# EAGLE board vr61-revB (EAGLE 9.6.2), part 1 of 2
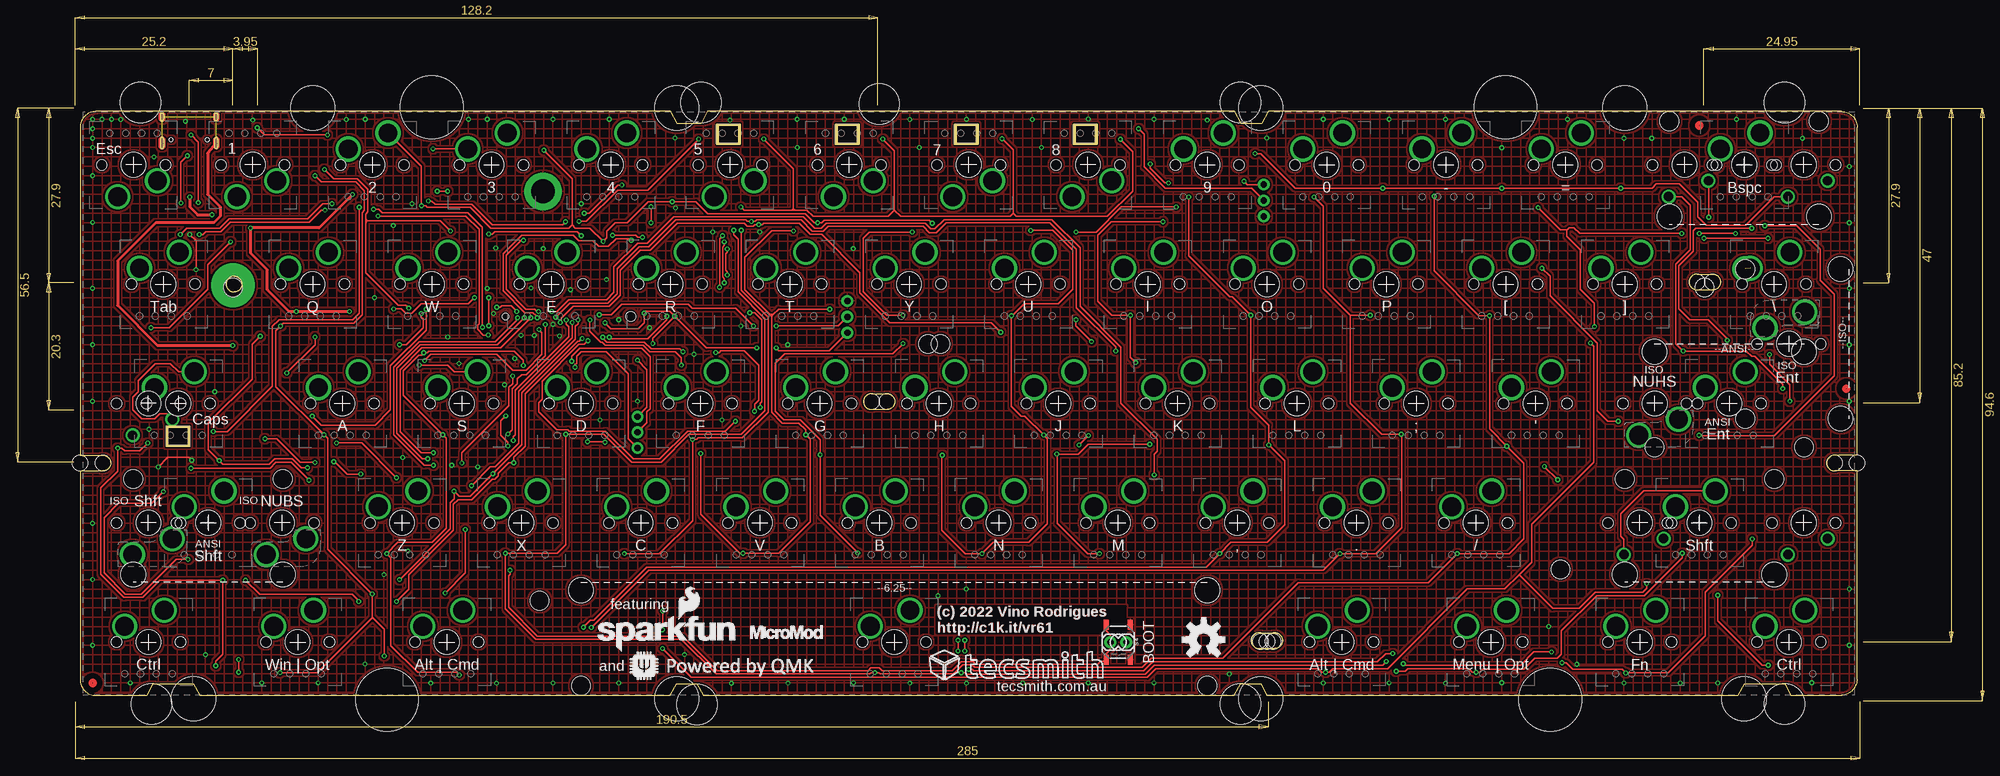
[diagram p2: board, top side]
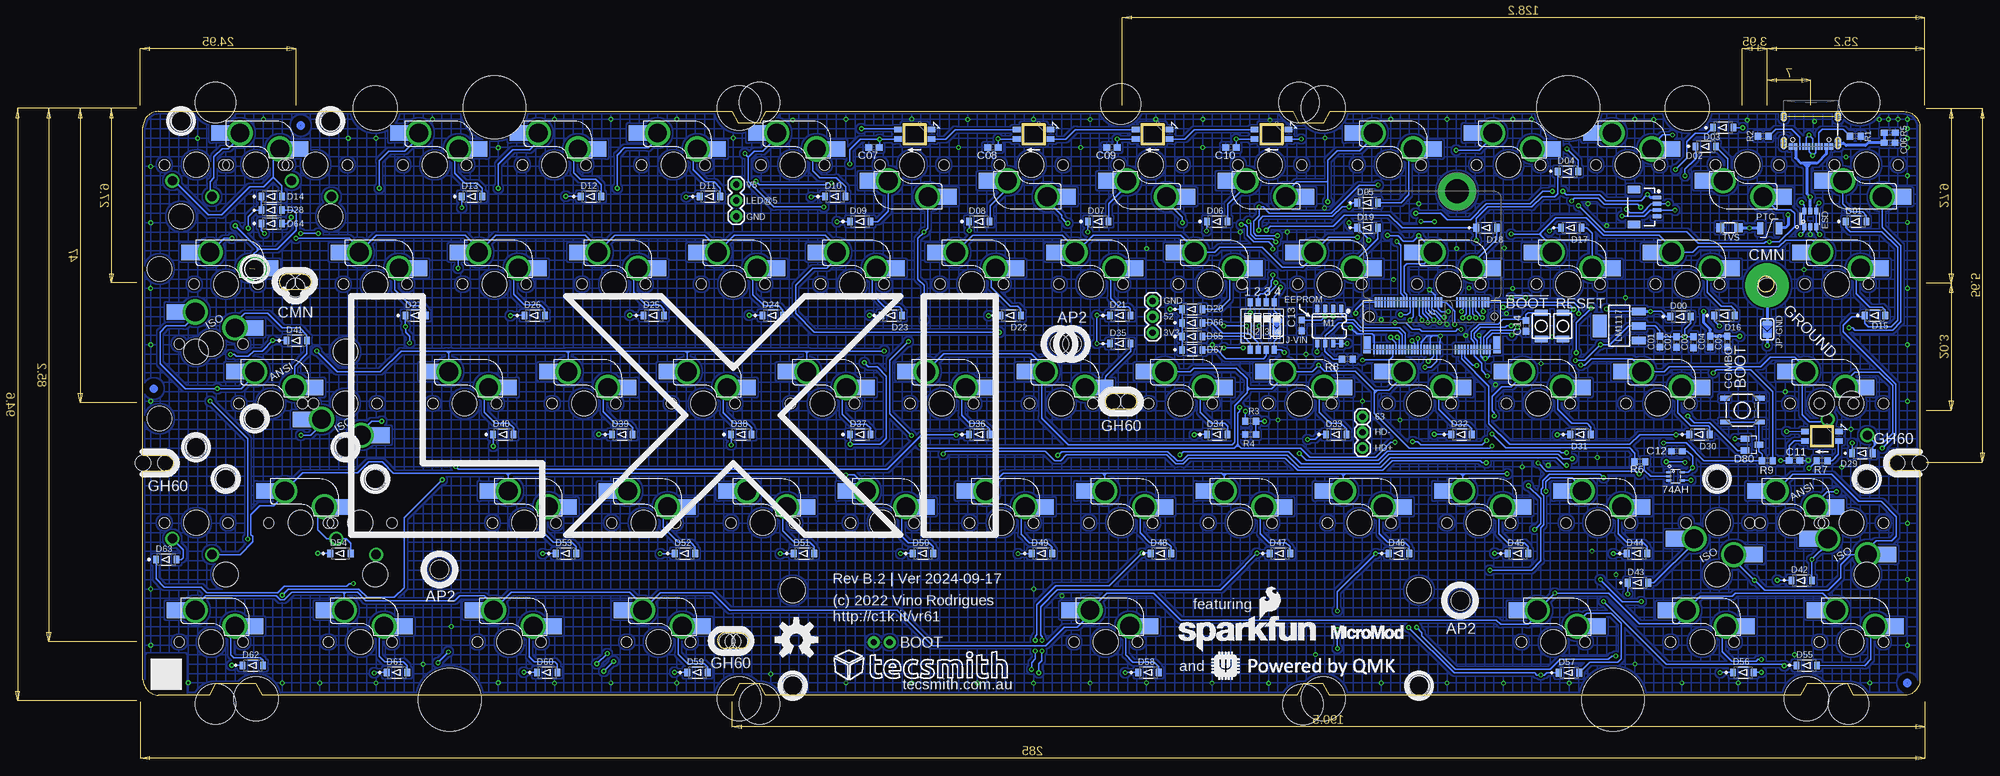
[diagram p3: board, bottom side, seen from below]

Size 314.35 x 118.85 mm. Coordinates in mm from the lower left corner, seen from the top.
Outline: 291.26,46.47 291.14,46.47
Outline: 136.6,58.47 arc180 136.65,55.97 139.14,55.97 arc180 139.12,58.47 136.6,58.47
Copper layers (1*16): Top 0.035mm / dielectric 1.5mm / Bottom 0.035mm
Design rules "jlcpcb *": minimum track width 5mil, minimum drill 0.3mm, track to track 9.5mil, track to pad 9.5mil, pad to pad 9.5mil, via to via 9.5mil, smd to smd 9.5mil, copper to edge 0.2mm, drill to drill 6mil, minimum pad ring 3mil, minimum via ring 8mil, stop-mask expansion 0mil, vias tented up to drill 15mil, thermal gap 10mil
Net classes: 0 default: width 0 mm, drill 0 mm
Holes 2.5 mm at 199.8,18.9 198.8,18.9 200.8,18.9

## Footprints (pad centres in the part's own frame; a part is rotated, then mirrored left to right if it is on the bottom)
SC-88A__TSSOP5__SOT353-1 = smd 0.375 x 0.825: 1 -0.65,-1.087; 2 0,-1.087; 3 0.65,-1.087; 4 0.65,1.087; 6 -0.65,1.087
0603 = smd 1.1 x 1: 1 -0.85,0; 2 0.85,0
C0603 = smd 1.1 x 1: 1 -0.85,0; 2 0.85,0
SOD-123 = smd 0.914 x 1.219: A 1.638,0; C -1.638,0
SOT23 = smd 1 x 1.4: 1 -0.95,-1.1; 2 0.95,-1.1; 3 0,1.1
DIP-1.27-004 = smd 0.76 x 1.27: 1 -1.905,-3.81; 2 -0.635,-3.81; 3 0.635,-3.81; 4 1.905,-3.81; 5 1.905,3.81; 6 0.635,3.81; 7 -0.635,3.81; 8 -1.905,3.81
SOT-23-6L = smd 0.6 x 1.1: P$1 -0.95,-1.25; P$2 0,-1.25; P$3 0.95,-1.25; P$4 0.95,1.25; P$5 0,1.25; P$6 -0.95,1.25
FOOTPRINT-AP2 = hole 3: 24,65; 73,15; 137,56; 236,20; 259,65; 135,56
STAND-OFF-REFLOW-M2.5 = drill 3.8 pad 6: 1 0,0
1X03 = drill 1.016 pad 1.88: 1 0,0; 2 2.54,0; 3 5.08,0
1X01 = drill 1.016 pad 1.88: 1 0,0
1X02 = drill 1.016 pad 1.88: 1 0,0; 2 2.54,0
USB-C-16P = smd 0.3 x 1: A5 -1.25,-0.34; A6 -0.25,-0.34; A7 0.25,-0.34; A8 1.25,-0.34; B5 1.75,-0.34; B6 0.75,-0.34; B7 -0.75,-0.34; B8 -1.75,-0.34 | smd 0.6 x 1: GND -3.225,-0.34; GND2 3.225,-0.34; VBUS1 -2.45,-0.34; VBUS2 2.45,-0.34 | smd 1 x 2.1: SHLD1 -4.32,-0.915; SHLD2 4.32,-0.915 | smd 1 x 2.1 bottom: SHLD3 -4.32,-0.915; SHLD4 4.32,-0.915 | smd 1 x 1.6: SHLD5 -4.32,-5.095; SHLD8 4.32,-5.095 | smd 1 x 1.6 bottom: SHLD6 -4.32,-5.095; SHLD7 4.32,-5.095 | hole 0.65: -2.89,-1.445; 2.89,-1.445
1X04_1MM_RA = smd 0.6 x 1.35: 1 -1.5,0; 2 -0.5,0; 3 0.5,0; 4 1.5,0 | smd 1.2 x 2: NC1 2.8,-3.675; NC2 -2.8,-3.675
SOLDERJUMPER_ARROW_NOPASTE = smd 0.762 x 1.524: 1 -1.016,0; 2 1.016,0
SK6812-E-MILL = smd 1.2 x 0.9 bottom: 1-VDD 2.7,-0.75; 2-DOUT 2.7,0.75; 3-GND -2.7,0.75; 4-DIN -2.7,-0.75
SOT223 = smd 1.219 x 2.235: 1 -2.311,-3.099; 2 0,-3.099; 3 2.311,-3.099 | smd 3.6 x 2.2: 4 0,3.099
8-SOIC = smd 0.6 x 1.2: 1 -1.905,-2.8; 2 -0.635,-2.8; 3 0.635,-2.8; 4 1.905,-2.8; 5 1.905,2.8; 6 0.635,2.8; 7 -0.635,2.8; 8 -1.905,2.8
SMD_PTC = smd 1 x 1.9: P$1 -1.5,0; P$2 1.5,0
R0603 = smd 1 x 1.1: 1 -0.85,0; 2 0.85,0
SKRKAEE020 = smd 1 x 2: 1 -2.1,0; 2 2.1,0
TACTILE_SWITCH_SMD_5.2MM = smd 1.524 x 0.762: 1 -2.794,1.905; 2 2.794,1.905; 3 -2.794,-1.905; 4 2.794,-1.905
MX-5-PIN-HOTSWAP-PAD = smd 3.15 x 2.5 bottom: 1@1 -6.785,2.54; 2@1 5.542,5.08 | drill 3 pad 3.75: 1@2 -3.81,2.54; 2@2 2.54,5.08 | hole 3.988: 0,0 | hole 1.7: -5.08,0; 5.08,0
MX-5-PIN-HOTSWAP-PAD-NS = smd 3.15 x 2.5 bottom: 1@1 -6.785,2.54; 2@1 5.542,5.08 | drill 3 pad 3.75: 1@2 -3.81,2.54; 2@2 2.54,5.08 | hole 3.988: 0,0 | hole 1.7: -5.08,0; 5.08,0
MX-5-PIN-MILMAX-3305-X-NS = drill 1.5: 1 -3.81,2.54; 2 2.54,5.08 | hole 3.988: 0,0 | hole 1.7: -5.08,0; 5.08,0
MX-STABS-200U = hole 3.988: -11.938,8.255; 11.938,8.255 | hole 3.048: -11.938,-6.985; 11.938,-6.985
MX-STABS-625U = hole 3.988: -50,8.255; 50,8.255 | hole 3.048: -50,-6.985; 50,-6.985
SOD123FL-BI = smd 1.3 x 1.4: P$1 -1.45,0; P$2 1.45,0
FOOTPRINT-BAKENEKO60 = hole 6.5: 10.6,95.65; 100.14,95.65; 186.3,95.65; 273.15,95.65; 12.4,-0.4; 99.46,-0.41; 186.3,-0.4; 273.15,-0.4 | hole 7.11: 38.13,94.78; 96.25,94.78; 189.5,94.78; 247.62,94.78; 19.08,0.47; 96.25,0.47; 189.5,0.47; 266.68,0.47 | hole 10.04: 57.15,94.92; 228.6,94.92; 50.01,0.31; 235.74,0.31 | hole 6.47: 128.59,95.46 | hole 2.5: 4.616,38.1; 281.134,38.1; 25.575,66.675; 1,38.1; 284.75,38.1; 261.675,67.025; 259.175,67.025; 129.837,47.924; 127.337,47.924; 189.244,9.76; 191.744,9.76
M.2-CONNECTOR-E = smd 0.3 x 1.55: 1 9.25,-5.275; 2 9,2.275; 3 8.75,-5.275; 4 8.5,2.275; 5 8.25,-5.275; 6 8,2.275; 7 7.75,-5.275; 8 7.5,2.275; 9 7.25,-5.275; 10 7,2.275; 11 6.75,-5.275; 12 6.5,2.275; 13 6.25,-5.275; 14 6,2.275; 15 5.75,-5.275; 16 5.5,2.275; 17 5.25,-5.275; 18 5,2.275; 19 4.75,-5.275; 20 4.5,2.275; 21 4.25,-5.275; 22 4,2.275; 23 3.75,-5.275; 32 1.5,2.275; 33 1.25,-5.275; 34 1,2.275; 35 0.75,-5.275; 36 0.5,2.275; 37 0.25,-5.275; 38 0,2.275; 39 -0.25,-5.275; 40 -0.5,2.275; 41 -0.75,-5.275; 42 -1,2.275; 43 -1.25,-5.275; 44 -1.5,2.275; 45 -1.75,-5.275; 46 -2,2.275; 47 -2.25,-5.275; 48 -2.5,2.275; 49 -2.75,-5.275; 50 -3,2.275; 51 -3.25,-5.275; 52 -3.5,2.275; 53 -3.75,-5.275; 54 -4,2.275; 55 -4.25,-5.275; 56 -4.5,2.275; 57 -4.75,-5.275; 58 -5,2.275; 59 -5.25,-5.275; 60 -5.5,2.275; 61 -5.75,-5.275; 62 -6,2.275; 63 -6.25,-5.275; 64 -6.5,2.275; 65 -6.75,-5.275; 66 -7,2.275; 67 -7.25,-5.275; 68 -7.5,2.275; 69 -7.75,-5.275; 70 -8,2.275; 71 -8.25,-5.275; 72 -8.5,2.275; 73 -8.75,-5.275; 74 -9,2.275; 75 -9.25,-5.275 | smd 1.2 x 2.75: A1 10.35,-4.5; A2 -10.35,-4.5 | hole 1.1: 10,0 | hole 1.6: -10,0

## Placement (x,y rotation side)
74AH  74AHCT1G125GW  [SC-88A__TSSOP5__SOT353-1]  49.3,45.3 270 bottom
C01  100nF  [0603]  51.8,66.8 270 bottom
C02  22uF  [0603]  49.15,66.75 270 bottom
C03  4.7uF  [0603]  46.45,66.7 270 bottom
C04  100nF  [0603]  43.75,66.8 270 bottom
C05  22uF  [0603]  41.05,66.8 270 bottom
C06  4.7nF  [0603]  15.12,98.57 0 bottom
C07  100nF  [C0603]  177.3,97.8 180 bottom
C08  100nF  [C0603]  158.3,97.8 180 bottom
C09  100nF  [C0603]  139.3,97.8 180 bottom
C10  100nF  [C0603]  120.3,97.8 180 bottom
C11  100nF  [C0603]  30.3,47.8 0 bottom
C12  0.1uF  [C0603]  49.1,49.3 180 bottom
C13  100nF  [C0603]  109,69.4 270 bottom
C14  100nF  [C0603]  73.2,69.33 270 bottom
D00  B5819W SL  [SOD-123]  48.5,70.8 0 bottom
D01  [SOD-123]  20.48,85.97 0 bottom
D02  [SOD-123]  44.47,97.97 0 bottom
D03  [SOD-123]  41.69,100.97 0 bottom
D04  [SOD-123]  66.47,93.97 0 bottom
D05  [SOD-123]  98.47,88.97 0 bottom
D06  [SOD-123]  122.47,85.97 0 bottom
D07  [SOD-123]  141.48,85.97 0 bottom
D08  [SOD-123]  160.48,85.97 0 bottom
D09  [SOD-123]  179.48,85.97 0 bottom
D10  [SOD-123]  183.48,89.97 0 bottom
D11  [SOD-123]  203.48,89.97 0 bottom
D12  [SOD-123]  222.48,89.97 0 bottom
D13  [SOD-123]  241.48,89.97 0 bottom
D14  [SOD-123]  273.48,89.97 0 bottom
D15  [SOD-123]  17.48,70.97 0 bottom
D16  [SOD-123]  41.47,70.97 0 bottom
D17  [SOD-123]  65.97,84.97 0 bottom
D18  [SOD-123]  79.47,84.97 0 bottom
D19  [SOD-123]  98.47,84.97 0 bottom
D20  [SOD-123]  126.47,71.97 0 bottom
D21  [SOD-123]  137.98,70.97 0 bottom
D22  [SOD-123]  155.48,70.97 0 bottom
D23  [SOD-123]  174.48,70.97 0 bottom
D24  [SOD-123]  193.48,70.97 0 bottom
D25  [SOD-123]  212.48,70.97 0 bottom
D26  [SOD-123]  231.48,70.97 0 bottom
D27  [SOD-123]  250.48,70.97 0 bottom
D28  [SOD-123]  273.48,87.8 0 bottom
D29  [SOD-123]  19.48,48.97 0 bottom
D30  [SOD-123]  45.47,51.97 0 bottom
D31  [SOD-123]  64.47,51.97 0 bottom
D32  [SOD-123]  83.47,51.97 0 bottom
D33  [SOD-123]  103.47,51.97 0 bottom
D34  [SOD-123]  122.47,51.97 0 bottom
D35  [SOD-123]  137.98,66.47 0 bottom
D36  [SOD-123]  160.48,51.97 0 bottom
D37  [SOD-123]  179.48,51.97 0 bottom
D38  [SOD-123]  198.48,51.97 0 bottom
D39  [SOD-123]  217.48,51.97 0 bottom
D40  [SOD-123]  236.48,51.97 0 bottom
D41  [SOD-123]  269.48,66.97 0 bottom
D42  [SOD-123]  29.18,28.68 0 bottom
D43  [SOD-123]  55.3,28.3 0 bottom
D44  [SOD-123]  55.47,32.98 0 bottom
D45  [SOD-123]  74.47,32.98 0 bottom
D46  [SOD-123]  93.47,32.98 0 bottom
D47  [SOD-123]  112.47,32.98 0 bottom
D48  [SOD-123]  131.47,32.98 0 bottom
D49  [SOD-123]  150.48,32.98 0 bottom
D50  [SOD-123]  169.48,32.98 0 bottom
D51  [SOD-123]  188.48,32.98 0 bottom
D52  [SOD-123]  207.48,32.98 0 bottom
D53  [SOD-123]  226.48,32.98 0 bottom
D54  [SOD-123]  262.48,32.98 0 bottom
D55  [SOD-123]  28.34,15.1 0 bottom
D56  [SOD-123]  38.48,13.98 0 bottom
D57  [SOD-123]  66.3,13.94 0 bottom
D58  [SOD-123]  133.47,13.98 0 bottom
D59  [SOD-123]  205.48,13.98 0 bottom
D60  [SOD-123]  229.48,13.98 0 bottom
D61  [SOD-123]  253.48,13.98 0 bottom
D62  [SOD-123]  276.48,15.1 0 bottom
D63  [SOD-123]  290.3,32 0 bottom
D64  [SOD-123]  273.48,85.65 0 bottom
D65  [SOD-123]  126.47,67.62 0 bottom
D66  [SOD-123]  126.47,69.8 0 bottom
D67  [SOD-123]  126.47,65.47 0 bottom
D80  BAS70-05  [SOT23]  37.1,50.35 270 bottom
DIP-SW  DIP004  [DIP-1.27-004]  115.3,69.3 0 bottom
ESD  ESD_SRV05-4  [SOT-23-6L]  27.8,86.4 0 bottom
FP_AP2  FOOTPRINT-AP2  [FOOTPRINT-AP2]  10.68,10.43 0 top
H5  STAND-OFF-REFLOW2.5MM_TALL  [STAND-OFF-REFLOW-M2.5]  84.2,90.79 0 top
J-52  [1X03]  132.8,73.3 270 bottom
J-63  [1X01]  99.3,54.8 0 bottom
J-BOOT  [1X02]  174.8,18.8 0 top
J-HOST  [1X02]  99.3,49.8 90 bottom
J-LED  [1X03]  199.3,86.8 90 bottom
J-UBS  [USB-C-16P]  27.69,97.6 180 bottom
J-UDB  SM04B-SRSS-TB(LF)(SN)  [1X04_1MM_RA]  52.3,88.3 270 bottom
J-VIN  [SOLDERJUMPER_ARROW_NOPASTE]  113,69.28 270 bottom
JP-GND  G-OPT  [SOLDERJUMPER_ARROW_NOPASTE]  34.67,68.78 270 bottom
LED-5  SK6812-E-REVERSE  [SK6812-E-MILL]  113.8,99.9 0 top
LED-6  SK6812-E-REVERSE  [SK6812-E-MILL]  132.8,99.9 0 top
LED-7  SK6812-E-REVERSE  [SK6812-E-MILL]  151.8,99.9 0 top
LED-8  SK6812-E-REVERSE  [SK6812-E-MILL]  170.8,99.9 0 top
LED-CL  SK6812-E-REVERSE  [SK6812-E-MILL]  25.93,51.7 0 top
LM1117  AMS1117-3.3  [SOT223]  58.3,69.3 90 bottom
LOGO1  OSHW-LOGOL  [OSHW-LOGO-L]  189.7,19.2 0 top
LOGO2  OSHW-LOGOL  [OSHW-LOGO-L]  189.7,19.2 0 bottom
M1  M25C  [8-SOIC]  104.6,69.3 180 bottom
PTC  PTC_ASMD1206-150  [SMD_PTC]  34.3,84.9 180 bottom
R1  5.1K  [R0603]  20.6,99.6 0 bottom
R2  5.1K  [R0603]  35.3,99.6 180 bottom
R3  150K  [R0603]  117.15,54.1 180 bottom
R4  75K  [R0603]  117.15,51.97 0 bottom
R5  1000K  [0603]  15.1,100.16 180 bottom
R6  220  [R0603]  55,47.65 180 bottom
R7  470  [R0603]  25.9,47.8 180 bottom
R8  5.1K  [R0603]  101.7,64 180 bottom
R9  5.1K  [R0603]  34.65,47.8 0 bottom
S1  [SKRKAEE020]  67.3,69.3 90 bottom
S2  [SKRKAEE020]  70.75,69.33 90 bottom
S3  BOOT  [TACTILE_SWITCH_SMD_5.2MM]  38.64,55.86 0 bottom
S4  BOOT  [TACTILE_SWITCH_SMD_5.2MM]  176.05,18.8 270 top
S_0  MX-5-PIN-HOTSWAP-PAD  [MX-5-PIN-HOTSWAP-PAD]  209.33,95.02 0 top
S_1  MX-5-PIN-HOTSWAP-PAD  [MX-5-PIN-HOTSWAP-PAD]  37.88,95.02 180 top
S_2  MX-5-PIN-HOTSWAP-PAD  [MX-5-PIN-HOTSWAP-PAD]  56.92,95.02 0 top
S_3  MX-5-PIN-HOTSWAP-PAD  [MX-5-PIN-HOTSWAP-PAD]  75.97,95.02 0 top
S_4  MX-5-PIN-HOTSWAP-PAD  [MX-5-PIN-HOTSWAP-PAD]  95.02,95.02 0 top
S_5  MX-5-PIN-HOTSWAP-PAD  [MX-5-PIN-HOTSWAP-PAD]  114.08,95.02 180 top
S_6  MX-5-PIN-HOTSWAP-PAD  [MX-5-PIN-HOTSWAP-PAD]  133.12,95.02 180 top
S_7  MX-5-PIN-HOTSWAP-PAD  [MX-5-PIN-HOTSWAP-PAD]  152.18,95.02 180 top
S_8  MX-5-PIN-HOTSWAP-PAD  [MX-5-PIN-HOTSWAP-PAD]  171.23,95.02 180 top
S_9  MX-5-PIN-HOTSWAP-PAD  [MX-5-PIN-HOTSWAP-PAD]  190.28,95.02 0 top
S_A  MX-5-PIN-HOTSWAP-PAD  [MX-5-PIN-HOTSWAP-PAD]  52.16,56.92 0 top
S_APP  MX-5-PIN-HOTSWAP-PAD  [MX-5-PIN-HOTSWAP-PAD]  235.52,18.83 0 top
S_B  MX-5-PIN-HOTSWAP-PAD  [MX-5-PIN-HOTSWAP-PAD]  137.89,37.88 0 top
S_BSLS  MX-5-PIN-HOTSWAP-PAD  [MX-5-PIN-HOTSWAP-PAD]  280.76,75.97 0 top
S_BSLS2  MX-5-PIN-HOTSWAP-PADNO-SILK  [MX-5-PIN-HOTSWAP-PAD-NS]  261.71,56.92 180 top
S_BSPC  MX-5-PIN-HOTSWAP-PAD  [MX-5-PIN-HOTSWAP-PAD]  276,95.02 0 top
S_BSPC2  MX-5-PIN-MILMAX-3305-XNO-SILK  [MX-5-PIN-MILMAX-3305-X-NS]  285.53,95.02 180 top
S_C  MX-5-PIN-HOTSWAP-PAD  [MX-5-PIN-HOTSWAP-PAD]  99.79,37.88 0 top
S_CAPS  MX-5-PIN-HOTSWAP-PAD  [MX-5-PIN-HOTSWAP-PAD]  25.97,56.92 0 top
S_CAPS2  MX-5-PIN-MILMAX-3305-XNO-SILK  [MX-5-PIN-MILMAX-3305-X-NS]  21.21,56.92 180 top
S_COM  MX-5-PIN-HOTSWAP-PAD  [MX-5-PIN-HOTSWAP-PAD]  195.04,37.88 0 top
S_D  MX-5-PIN-HOTSWAP-PAD  [MX-5-PIN-HOTSWAP-PAD]  90.26,56.92 0 top
S_DOT  MX-5-PIN-HOTSWAP-PAD  [MX-5-PIN-HOTSWAP-PAD]  214.09,37.88 0 top
S_E  MX-5-PIN-HOTSWAP-PAD  [MX-5-PIN-HOTSWAP-PAD]  85.5,75.97 0 top
S_ENT  MX-5-PIN-HOTSWAP-PAD  [MX-5-PIN-HOTSWAP-PAD]  273.62,56.92 0 top
S_ENT2  MX-5-PIN-HOTSWAP-PADNO-SILK  [MX-5-PIN-HOTSWAP-PAD-NS]  283.14,66.45 0 top
S_EQL  MX-5-PIN-HOTSWAP-PAD  [MX-5-PIN-HOTSWAP-PAD]  247.43,95.02 0 top
S_ESC  MX-5-PIN-HOTSWAP-PAD  [MX-5-PIN-HOTSWAP-PAD]  18.83,95.02 180 top
S_F  MX-5-PIN-HOTSWAP-PAD  [MX-5-PIN-HOTSWAP-PAD]  109.31,56.92 0 top
S_FN  MX-5-PIN-MILMAX-3305-XNO-SILK  [MX-5-PIN-MILMAX-3305-X-NS]  285.53,37.88 180 top
S_FN1  MX-5-PIN-HOTSWAP-PAD  [MX-5-PIN-HOTSWAP-PAD]  211.71,18.83 0 top
S_G  MX-5-PIN-HOTSWAP-PAD  [MX-5-PIN-HOTSWAP-PAD]  128.36,56.92 0 top
S_H  MX-5-PIN-HOTSWAP-PAD  [MX-5-PIN-HOTSWAP-PAD]  147.41,56.92 0 top
S_I  MX-5-PIN-HOTSWAP-PAD  [MX-5-PIN-HOTSWAP-PAD]  180.75,75.97 0 top
S_J  MX-5-PIN-HOTSWAP-PAD  [MX-5-PIN-HOTSWAP-PAD]  166.46,56.92 0 top
S_K  MX-5-PIN-HOTSWAP-PAD  [MX-5-PIN-HOTSWAP-PAD]  185.51,56.92 0 top
S_L  MX-5-PIN-HOTSWAP-PAD  [MX-5-PIN-HOTSWAP-PAD]  204.56,56.92 0 top
S_LALT  MX-5-PIN-HOTSWAP-PAD  [MX-5-PIN-HOTSWAP-PAD]  68.83,18.83 0 top
S_LBRC  MX-5-PIN-HOTSWAP-PAD  [MX-5-PIN-HOTSWAP-PAD]  237.9,75.97 0 top
S_LCTL  MX-5-PIN-HOTSWAP-PAD  [MX-5-PIN-HOTSWAP-PAD]  21.21,18.83 0 top
S_LGUI  MX-5-PIN-HOTSWAP-PAD  [MX-5-PIN-HOTSWAP-PAD]  45.02,18.83 0 top
S_LSFT  MX-5-PIN-HOTSWAP-PAD  [MX-5-PIN-HOTSWAP-PAD]  30.73,37.88 0 top
S_LSFT2  MX-5-PIN-HOTSWAP-PADNO-SILK  [MX-5-PIN-HOTSWAP-PAD-NS]  21.21,37.88 180 top
S_M  MX-5-PIN-HOTSWAP-PAD  [MX-5-PIN-HOTSWAP-PAD]  175.99,37.88 0 top
S_MINS  MX-5-PIN-HOTSWAP-PAD  [MX-5-PIN-HOTSWAP-PAD]  228.38,95.02 0 top
S_N  MX-5-PIN-HOTSWAP-PAD  [MX-5-PIN-HOTSWAP-PAD]  156.94,37.88 0 top
S_NUBS  MX-5-PIN-HOTSWAP-PADNO-SILK  [MX-5-PIN-HOTSWAP-PAD-NS]  42.54,37.88 180 top
S_O  MX-5-PIN-HOTSWAP-PAD  [MX-5-PIN-HOTSWAP-PAD]  199.8,75.97 0 top
S_P  MX-5-PIN-HOTSWAP-PAD  [MX-5-PIN-HOTSWAP-PAD]  218.85,75.97 0 top
S_Q  MX-5-PIN-HOTSWAP-PAD  [MX-5-PIN-HOTSWAP-PAD]  47.4,75.97 0 top
S_QUOT  MX-5-PIN-HOTSWAP-PAD  [MX-5-PIN-HOTSWAP-PAD]  242.66,56.92 0 top
S_R  MX-5-PIN-HOTSWAP-PAD  [MX-5-PIN-HOTSWAP-PAD]  104.55,75.97 0 top
S_RALT  MX-5-PIN-HOTSWAP-PAD  [MX-5-PIN-HOTSWAP-PAD]  259.33,18.83 0 top
S_RBRC  MX-5-PIN-HOTSWAP-PAD  [MX-5-PIN-HOTSWAP-PAD]  256.95,75.97 0 top
S_RCTL  MX-5-PIN-HOTSWAP-PAD  [MX-5-PIN-HOTSWAP-PAD]  283.14,18.83 0 top
S_RSFT  MX-5-PIN-HOTSWAP-PAD  [MX-5-PIN-HOTSWAP-PAD]  268.86,37.88 0 top
S_RSFT2  MX-5-PIN-MILMAX-3305-XNO-SILK  [MX-5-PIN-MILMAX-3305-X-NS]  259.33,37.88 180 top
S_S  MX-5-PIN-HOTSWAP-PAD  [MX-5-PIN-HOTSWAP-PAD]  71.21,56.92 0 top
S_SCLN  MX-5-PIN-HOTSWAP-PAD  [MX-5-PIN-HOTSWAP-PAD]  223.61,56.92 0 top
S_SLSH  MX-5-PIN-HOTSWAP-PAD  [MX-5-PIN-HOTSWAP-PAD]  233.14,37.88 0 top
S_SPARE  MX-5-PIN-MILMAX-3305-XNO-SILK  [MX-5-PIN-MILMAX-3305-X-NS]  266.48,95.02 180 top
S_SPC  MX-5-PIN-HOTSWAP-PAD  [MX-5-PIN-HOTSWAP-PAD]  140.27,18.83 0 top
S_T  MX-5-PIN-HOTSWAP-PAD  [MX-5-PIN-HOTSWAP-PAD]  123.6,75.97 0 top
S_TAB  MX-5-PIN-HOTSWAP-PAD  [MX-5-PIN-HOTSWAP-PAD]  23.59,75.97 0 top
S_U  MX-5-PIN-HOTSWAP-PAD  [MX-5-PIN-HOTSWAP-PAD]  161.7,75.97 0 top
S_V  MX-5-PIN-HOTSWAP-PAD  [MX-5-PIN-HOTSWAP-PAD]  118.84,37.88 0 top
S_W  MX-5-PIN-HOTSWAP-PAD  [MX-5-PIN-HOTSWAP-PAD]  66.45,75.97 0 top
S_X  MX-5-PIN-HOTSWAP-PAD  [MX-5-PIN-HOTSWAP-PAD]  80.74,37.88 0 top
S_Y  MX-5-PIN-HOTSWAP-PAD  [MX-5-PIN-HOTSWAP-PAD]  142.65,75.97 0 top
S_Z  MX-5-PIN-HOTSWAP-PAD  [MX-5-PIN-HOTSWAP-PAD]  61.69,37.88 0 top
T_BSPC  MX-STABS-200U  [MX-STABS-200U]  276,95.02 180 top
T_ENT  MX-STABS-200U  [MX-STABS-200U]  273.62,56.92 0 top
T_ENT1  MX-STABS-200U  [MX-STABS-200U]  283.14,66.45 270 top
T_LSFT  MX-STABS-200U  [MX-STABS-200U]  30.73,37.88 180 top
T_RSFT  MX-STABS-200U  [MX-STABS-200U]  268.86,37.88 180 top
T_SPC  MX-STABS-625U  [MX-STABS-625U]  140.27,18.83 0 top
TVS  TVS_SMF9.0CA  [SOD123FL-BI]  40.7,85 180 bottom
U$3  MICROMOD-LOGO  [MICROMOD-LOGO]  117.3,19.3 0 top
U$5  SPARKFUN_LOGO0.2  [SFE_LOGO_NAME_FLAME_.2]  92.3,17.3 0 top
U$6  QMK_LOGO  [QMK_LOGO]  98,12.7 0 top
U$7  TECSMITH-LOGOLONG  [TECSMITH-NAME]  181.3,15.3 0 bottom
U$8  TECSMITH-LOGOLONG  [TECSMITH-NAME]  148.3,15.3 0 top
U$10  SPARKFUN_LOGO0.2  [SFE_LOGO_NAME_FLAME_.2]  129.3,17.3 0 bottom
U$12  QMK_LOGO  [QMK_LOGO]  123.5,12.7 0 bottom
U$13  MICROMOD-LOGO  [MICROMOD-LOGO]  104.3,19.3 0 bottom
U$20  FIDUCIAL  [FIDUCIAL]  12.3,12.3 0 top
U$21  FIDUCIAL  [FIDUCIAL]  268.82,101.3 0 top
U$22  FIDUCIAL  [FIDUCIAL]  292.3,59.3 0 top
U$24  FOOTPRINT-BAKENEKO60  [FOOTPRINT-BAKENEKO60]  9.3,9.3 0 top
U$25  FOOTPRINT-DIMS-GH60  [FOOTPRINT-DIMS-GH60]  9.3,9.3 0 top
U$26  ?  [JLC_ORDER_NUMBER_QR_5X5]  290.3,13.7 0 bottom
X1  MICROMOD-2222-C  [M.2-CONNECTOR-E]  88.2,70.8 0 bottom